# EAGLE design ShieldDuckSensor (EAGLE 6.5.0)
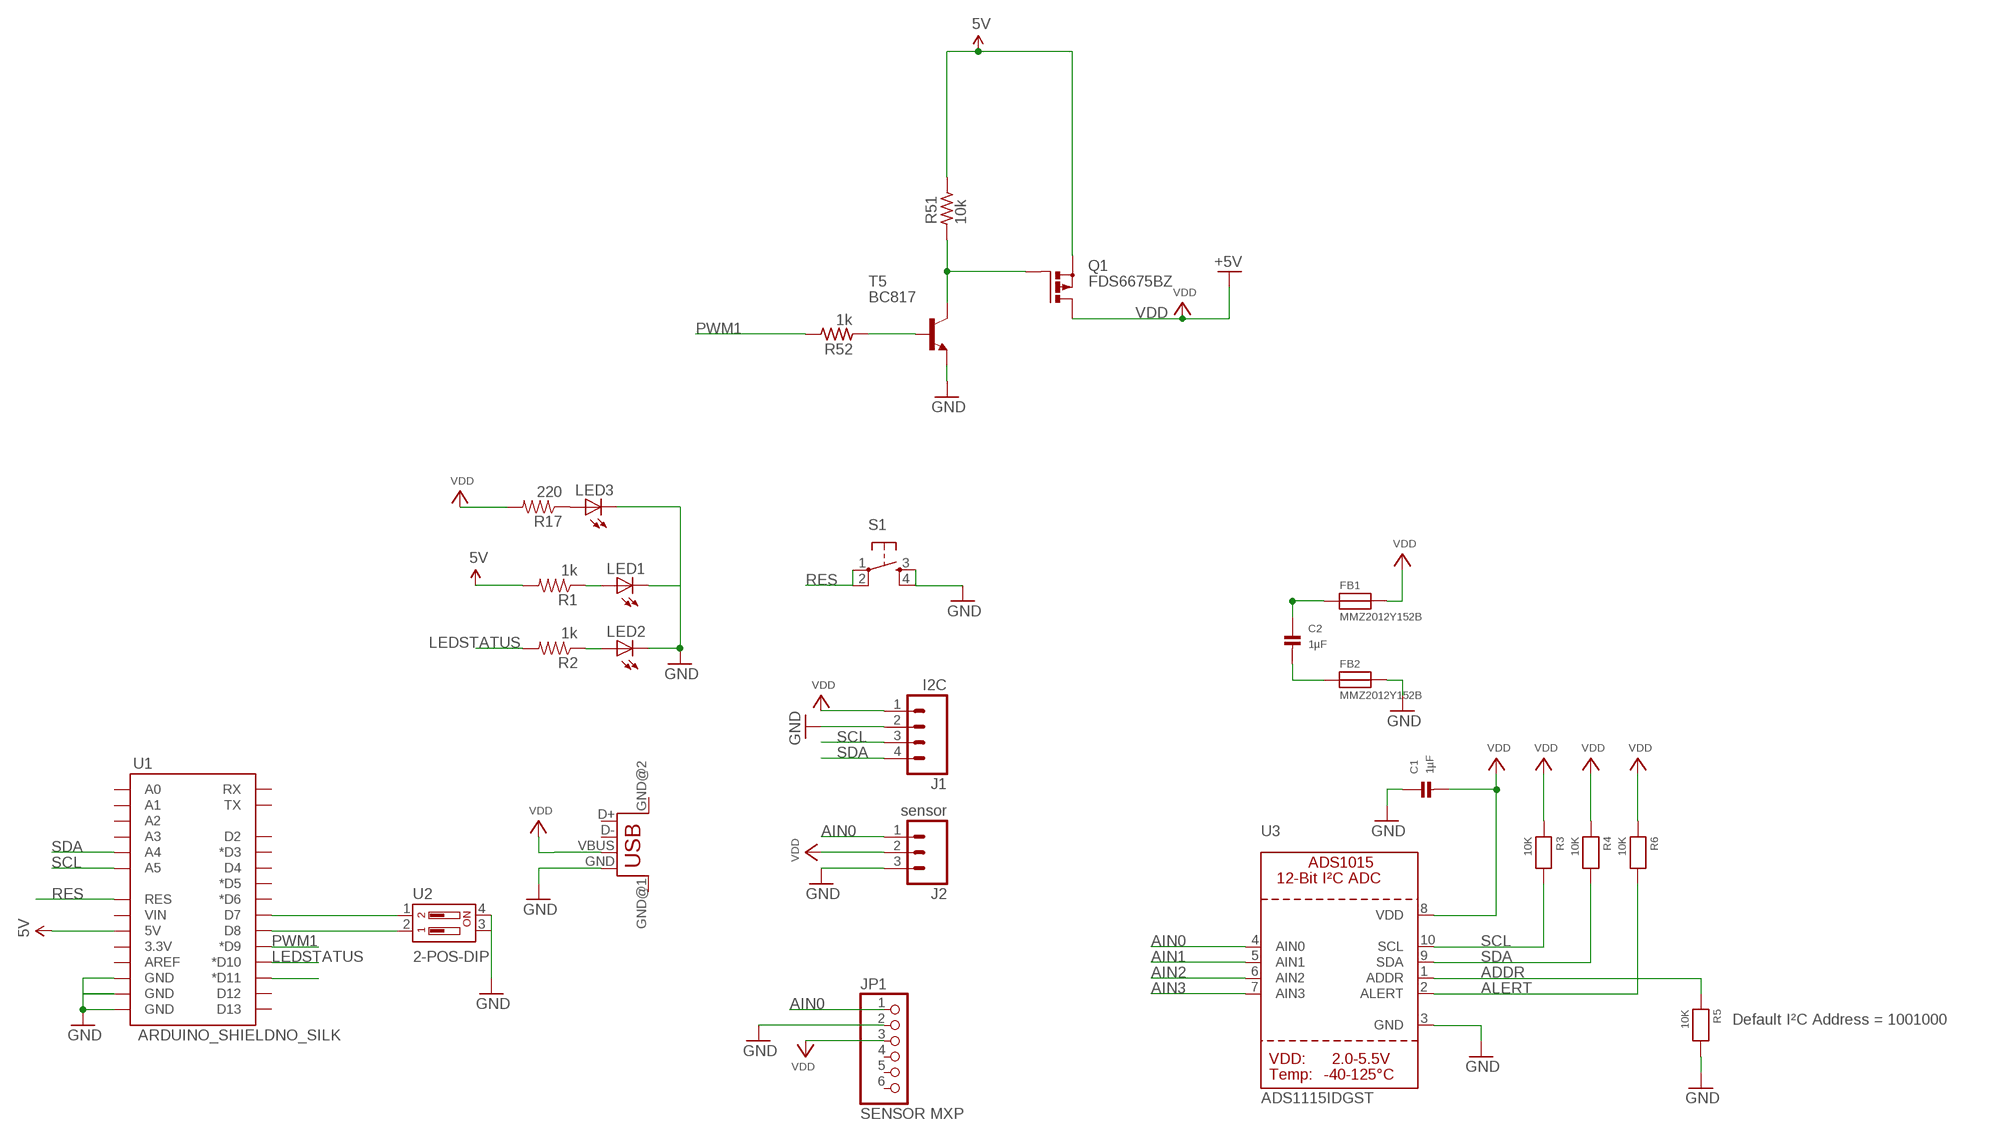
[diagram p0: schematic, sheet 1]

## Parts
C1  1µF  CAP_CERAMIC0805  [0805]
C2  1µF  CAP_CERAMIC0805  [0805]
FB1  MMZ2012Y152B  FERRITE0805  [0805]
FB2  MMZ2012Y152B  FERRITE0805  [0805]
J1  I2C  M04PTH  [1X04]
J2  sensor  M03PTH  [1X03]
JP1  SENSOR MXP  PINHD-1X6B  [1X06-BIG]
LED1  LED3MM  [LED3MM]
LED2  LED3MM  [LED3MM]
LED3  LED3MM  [LED3MM]
Q1  FDS6675BZ  P-MOSFET-SO8  [SO-08]
R1  1k  RESISTOR0805-RES  [0805]
R2  1k  RESISTOR0805-RES  [0805]
R3  10K  RESISTOR0805  [0805]
R4  10K  RESISTOR0805  [0805]
R5  10K  RESISTOR0805  [0805]
R6  10K  RESISTOR0805  [0805]
R17  220  RESISTOR0805-RES  [0805]
R51  10k  R_0805  [R0805]
R52  1k  R_0805  [R0805]
S1  TAC_SWITCHPTH  [TACTILE-PTH]
T5  BC817  BC817-16LT1-NPN-SOT23-BEC  [SOT23-BEC]
U1  ARDUINO_SHIELDNO_SILK  [DUEMILANOVE_VIAS]
U2  2-POS-DIP  2-POS-DIPCTS-THRU-HOLE  [209-2LPST]
U3  ADS1115IDGST  ADC_ADS1015  [MSOP10]
U$1  USB  [USB-FEMALE-A-PTH]

## Nets
5V: Q1.1(S) Q1.2(S) Q1.3(S) R1.2 R51.2 U1.5V
ADDR: R5.1 U3.1(ADDR)
AIN0: J2.1 JP1.1 U3.4(AIN0)
AIN1: U3.5(AIN1)
AIN2: U3.6(AIN2)
AIN3: U3.7(AIN3)
ALERT: R6.2 U3.2(ALERT)
GND: C1.1 FB2.2 J1.2 J2.3 JP1.2 LED1.K(C) LED2.K(C) LED3.K(C) R5.2 S1.3 S1.4 T5.E U1.GND@0(GND) U1.GND@1(GND) U1.GND@2(GND) U2.3 U2.4 U3.3(GND) U$1.GND
LEDSTATUS: R2.2 U1.D10(*D10)
N$2: LED1.A R1.1
N$3: U1.D7 U2.1
N$4: U1.D8 U2.2
N$5: LED2.A R2.1
N$6: C2.2 FB2.1
N$7: C2.1 FB1.1
N$11: U1.D11(*D11)
N$17: LED3.A R17.1
N$54: Q1.4(G) R51.1 T5.C
N$55: R52.1 T5.B
PWM1: R52.2 U1.D9(*D9)
RES: S1.1 S1.2 U1.RES
SCL: J1.3 R3.2 U1.A5 U3.10(SCL)
SDA: J1.4 R4.2 U1.A4 U3.9(SDA)
VDD: C1.2 FB1.2 J1.1 J2.2 JP1.3 Q1.5(D) Q1.6(D) Q1.7(D) Q1.8(D) R3.1 R4.1 R6.1 R17.2 U3.8(VDD) U$1.VBUS ; supply symbol labelled +5V
Unconnected: JP1.4 JP1.5 JP1.6 U1.3.3V U1.A0 U1.A1 U1.A2 U1.A3 U1.AREF U1.D2 U1.D3(*D3) U1.D4 U1.D5(*D5) U1.D6(*D6) U1.D12 U1.D13 U1.RX U1.TX U1.VIN U$1.D+ U$1.D- U$1.GND@1(GND) U$1.GND@2(GND)

## Notes on the sheet
- Default I²C Address = 1001000

## Library data of the parts
C1 C2 = microbuilder:CAP_CERAMIC: Ceramic Capacitors 0402 - 0402 Surface Mount Capacitors 16pF 50V 5% [Digikey: 445-4899-2-ND] 18pF 50V 5% [Digikey: 490-1281-2-ND] 22pF 50V 5% [Digikey: 490-1283-2-ND] 68pF 50V 5% [Digikey: 490-1289-2-ND] 0.1uF 10V 10% [Digikey: 490-1318-2-ND] 1.0uF 6.3V 10% [Digikey: 490-1320-2-ND] 0603 - 0603 Surface Mount Capacitors 16 pF 50V 5% [Digikey: 445-5051-2-ND] 22 pF 50V [Digikey: PCC220ACVTR-ND] 33 pF 50V 5% [Digikey: 490-1415-1-ND] 56pF 50V 5% [Digikey: 490-1421-1-ND] 220pF 50V 5% [Digikey: 445-1285-1-ND] 680 pF 50V 2200 pF 50V 5% C0G [Digikey: 445-1297-1-ND] 5600 pF 100V 5% X7R [Digikey: 478-3711-1-ND] 0.1 µF 25V 10% [Digikey: PCC2277TR-ND] 0.22 µF 16V 10% X7R [Digikey: 445-1318-1-ND] 1.0 µF 25V 10% [Digikey: 445-5146-2-ND] 0603 - RF Specific 3pF 250V +/-0.1pF RF [Digikey: 712-1347-1-ND] 18 pF 250V 5% [Digikey: 478-3505-1-ND or 712-1322-1-ND] 56 pF 250V 5% C0G RF [Digikey: 490-4867-1-ND] 68 pF 250V RF [Digikey: 490-4868-1-ND] 0805 - 0805 Surface Mount Capacitors 220 pF 250V 2% RF Ceramic Capacitor [Digikey: 712-1398-1-ND] 1000 pF 50V 2% NP0 Ceramic Capacitor [Digikey: 478-3760-1-ND] 0.1 µF 25V 10% Ceramic Capacitor [Digikey: PCC1828TR-ND] 1.0 µF 16V 10% Ceramic Capacitor[Digikey: 490-1691-2-ND] 10.0 µF 10V 10% Ceramic Capacitor[Digikey: 709-1228-1-ND] 10.0 uF 16V 10% Ceramic Capacitor [Digikey: 478-5165-2-ND] 47 uF 6.3V 20% Ceramic Capacitor [Digikey: 587-1779-1-ND or 399-5506-1-ND] 1206 - 1206 Surface Mount Capacitors 47uF 10V 20% Ceramic Capacitor [Digikey: 490-5528-1-ND or 399-5508-1-ND or 445-6010-1-ND] 100uF 6.3V -20%, +80% Y5V Ceramic Capacitor (Digikey: 490-4512-1-ND, Mouser: 81-GRM31CF50J107ZE1L)
FB1 FB2 = microbuilder:FERRITE: Ferrite Bead 0603 MMZ1608B121C - 120 Ohm, 600mA Ferrite Chip - Digikey: 445-2164-1-ND BK1608HW121-T - 120 Ohm, 600mA Ferrite Chip - Digikey: 587-1876-2-ND 0805 HZ0805B272R-10 - 2.7K Ohm @ 100MHz, 200mA 0.8 Ohm DC Resistance - Digikey: 240-2504-1-ND (see also Murata BLM21BD272SN1L)
J1 = SparkFun-Connectors:M04: Header 4 Standard 4-pin 0.1" header. Use with straight break away headers (SKU : PRT-00116), right angle break away headers (PRT-00553), swiss pins (PRT-00743), machine pins (PRT-00117), and female headers (PRT-00115). Molex polarized connector foot print use with SKU : PRT-08231 with associated crimp pins and housings. 1MM SMD Version SKU: PRT-10208; PROD_ID: CONN-09696
J2 = SparkFun-Connectors:M03: Header 3 Standard 3-pin 0.1" header. Use with straight break away headers (SKU : PRT-00116), right angle break away headers (PRT-00553), swiss pins (PRT-00743), machine pins (PRT-00117), and female headers (PRT-00115). Molex polarized connector foot print use with SKU : PRT-08232 with associated crimp pins and housings.
JP1 = adafruit:PINHD-1X6: PIN HEADER
LED1-LED3 = adafruit:LED: LED OSRAM: - CHIPLED LG R971, LG N971, LY N971, LG Q971, LY Q971, LO R971, LY R971 LH N974, LH R974 LS Q976, LO Q976, LY Q976 LO Q996 - Hyper CHIPLED LW Q18S LB Q993, LB Q99A, LB R99A - SideLED LS A670, LO A670, LY A670, LG A670, LP A670 LB A673, LV A673, LT A673, LW A673 LH A674 LY A675 LS A676, LA A676, LO A676, LY A676, LW A676 LS A679, LY A679, LG A679 - Hyper Micro SIDELED® LS Y876, LA Y876, LO Y876, LY Y876 LT Y87S - SmartLED LW L88C, LW L88S LB L89C, LB L89S, LG L890 LS L89K, LO L89K, LY L89K LS L896, LA L896, LO L896, LY L896 - TOPLED LS T670, LO T670, LY T670, LG T670, LP T670 LSG T670, LSP T670, LSY T670, LOP T670, LYG T670 LG T671, LOG T671, LSG T671 LB T673, LV T673, LT T673, LW T673 LH T674 LS T676, LA T676, LO T676, LY T676, LB T676, LH T676, LSB T676, LW T676 LB T67C, LV T67C, LT T67C, LS T67K, LO T67K, LY T67K, LW E67C LS E67B, LA E67B, LO E67B, LY E67B, LB E67C, LV E67C, LT E67C LW T67C LS T679, LY T679, LG T679 LS T770, LO T770, LY T770, LG T770, LP T770 LB T773, LV T773, LT T773, LW T773 LH T774 LS E675, LA E675, LY E675, LS T675 LS T776, LA T776, LO T776, LY T776, LB T776 LHGB T686 LT T68C, LB T68C - Hyper Mini TOPLED® LB M676 - Mini TOPLED Santana® LG M470 LS M47K, LO M47K, LY M47K Source: http://www.osram.convergy.de/
Q1 = transistor-power:P-MOSFET-SO8: P-Channel MOSFET Example: FDS4435A; P-Channel Logic Level PowerTrench® MOSFET FDS4465; P-Channel 1.8V Specified PowerTrench® MOSFET Source: www.fairchildsemi.com
R1 R2 R17 = SparkFun-Resistors:RESISTOR: Resistor Basic schematic elements and footprints for 0603, 1206, and PTH resistors.
R3-R6 = microbuilder:RESISTOR: Resistors 0402 - 0402 Surface Mount Package 22 Ohm 1% 1/16W [Digikey: 311-22.0LRTR-ND] 33 Ohm 5% 1/16W 1.0K 5% 1/16W 1.5K 5% 1/16W 2.0K 1% 1/16W 10.0K 1% 1/16W [Digikey: 311-10.0KLRTR-ND] 10.0K 5% 1/16W [Digikey: RMCF0402JT10K0TR-ND] 12.1K 1% 1/16W [Digikey: 311-22.0LRTR-ND] 100.0K 5% 1/16W 0603 - 0603 Surface Mount Package 0 Ohm 1/10 Watt 1% Resistor 15 Ohm 1/10 Watt 1% Resistor 33 Ohm 1/10 Watt 1% Resistor 49.9 Ohm 1/10 Watt 1% Resistor 100 Ohm 1/10 Watt 1% Resistor 150 Ohm 1/10 Watt 1% Resistor 240 Ohm 1/10 Watt 1% Resistor 390 Ohm 1/10 Watt 1% Resistor 560 Ohm 1/10 Watt 1% Resistor 680 Ohm 1/10 Watt 1% Resistor 750 Ohm 1/10 Watt 1% Resistor 1.0K Ohm 1/10 Watt 1% Resistor 1.5K Ohm 1/10 Watt 1% Resistor 2.0K Ohm 1/10 Watt 1% Resistor 2.2K Ohm 1/10 Watt 1% Resistor 3.3K Ohm 1/10 Watt 1% Resistor 4.7K Ohm 1/10 Watt 1% Resistor 10.0K Ohm 1/10 Watt 1% Resistor 12.0K Ohm 1/10 Watt 1% Resistor 12.1K Ohm 1/10 Watt 1% Resistor 20.0K Ohm 1/10 Watt 1% Resistor 33.0K Ohm 1/10 Watt 1% Resistor 100.0K Ohm 1/10 Watt 1% Resistor 0805 - 0805 Surface Mount Package 0 Ohm 1/8 Watt 1% Resistor 33 Ohm 1/8 Watt 1% Resistor 100 Ohm 1/8 Watt 1% Resistor 150 Ohm 1/8 Watt 1% Resistor 200 Ohm 1/8 Watt 1% Resistor 240 Ohm 1/8 Watt 1% Resistor 330 Ohm 1/8 Watt 1% Resistor 390 Ohm 1/8 Watt 1% Resistor 470 Ohm 1/8 Watt 1% Resistor 1.0K Ohm 1/8 Watt 1% Resistor 1.5K Ohm 1/8 Watt 1% Resistor 2.0K Ohm 1/8 Watt 1% Resistor 4.7K Ohm 1/8 Watt 1% Resistor 5.1K Ohm 1/8 Watt 1% Resistor 5.6K Ohm 1/8 Watt 1% Resistor 10.0K Ohm 1/8 Watt 1% Resistor 22.0K Ohm 1/8 Watt 1% Resistor 33.0K Ohm 1/8 Watt 1% Resistor 100K Ohm 1/8 Watt 1% Resistor 1206 - 1206 Surface Mount Package 2012 - 2010 Surface Mount Package 0.11 Ohm 1/2 Watt 1% Resistor - Digikey: RHM.11UCT-ND
R51 R52 = rc-master:R_: RESISTOR
S1 = SparkFun-Retired:TAC_SWITCH: Momentary Switch Button commonly used for reset or general input. Spark Fun Electronics SKU : COM-00097 SMT- SWCH-08247
T5 = transistor:*-NPN-: NPN Transistror BF959 corrected 2008.03.06
U1 = SparkFun-Boards:ARDUINO_SHIELD: Arduino shield footprint
U2 = SparkFun-Electromechanical:2-POS-DIP: SMD dip switch 2 positions; PROD_ID: SWCH-12532
U3 = microbuilder:ADC_ADS1015: ADS1015 - 12-bit 4-Channel I2C ADC with Internal PGA VDD: 2.0-5.5V Sampling Rate: 3.3ksps Gain Settings: 2/3, 1, 2, 4, 8, 16 I2C Address: ADDR low = 1001000x, ADDR high = 1001001x Internal Comparator The ADS1015 includes an internal comparator that can be set to output a high-level on ALERT when the conversion results exceeeds a pre-defined upper level, and will deassert itself when the level falls below a pre-defined lower threshold level. It can also be set to windowed mode where the ALERT pin will be asserted if the data exceeds the upper threshold or falls below the lower threshold.
U$1 = STUNTAZ:USB: USB Connectors USB-FEMALE-A-PTH: Through hole Female Type A Connector

## Net classes
1 power: width 0.508 mm, drill 0.305 mm, clearance 0.381 mm

## Board
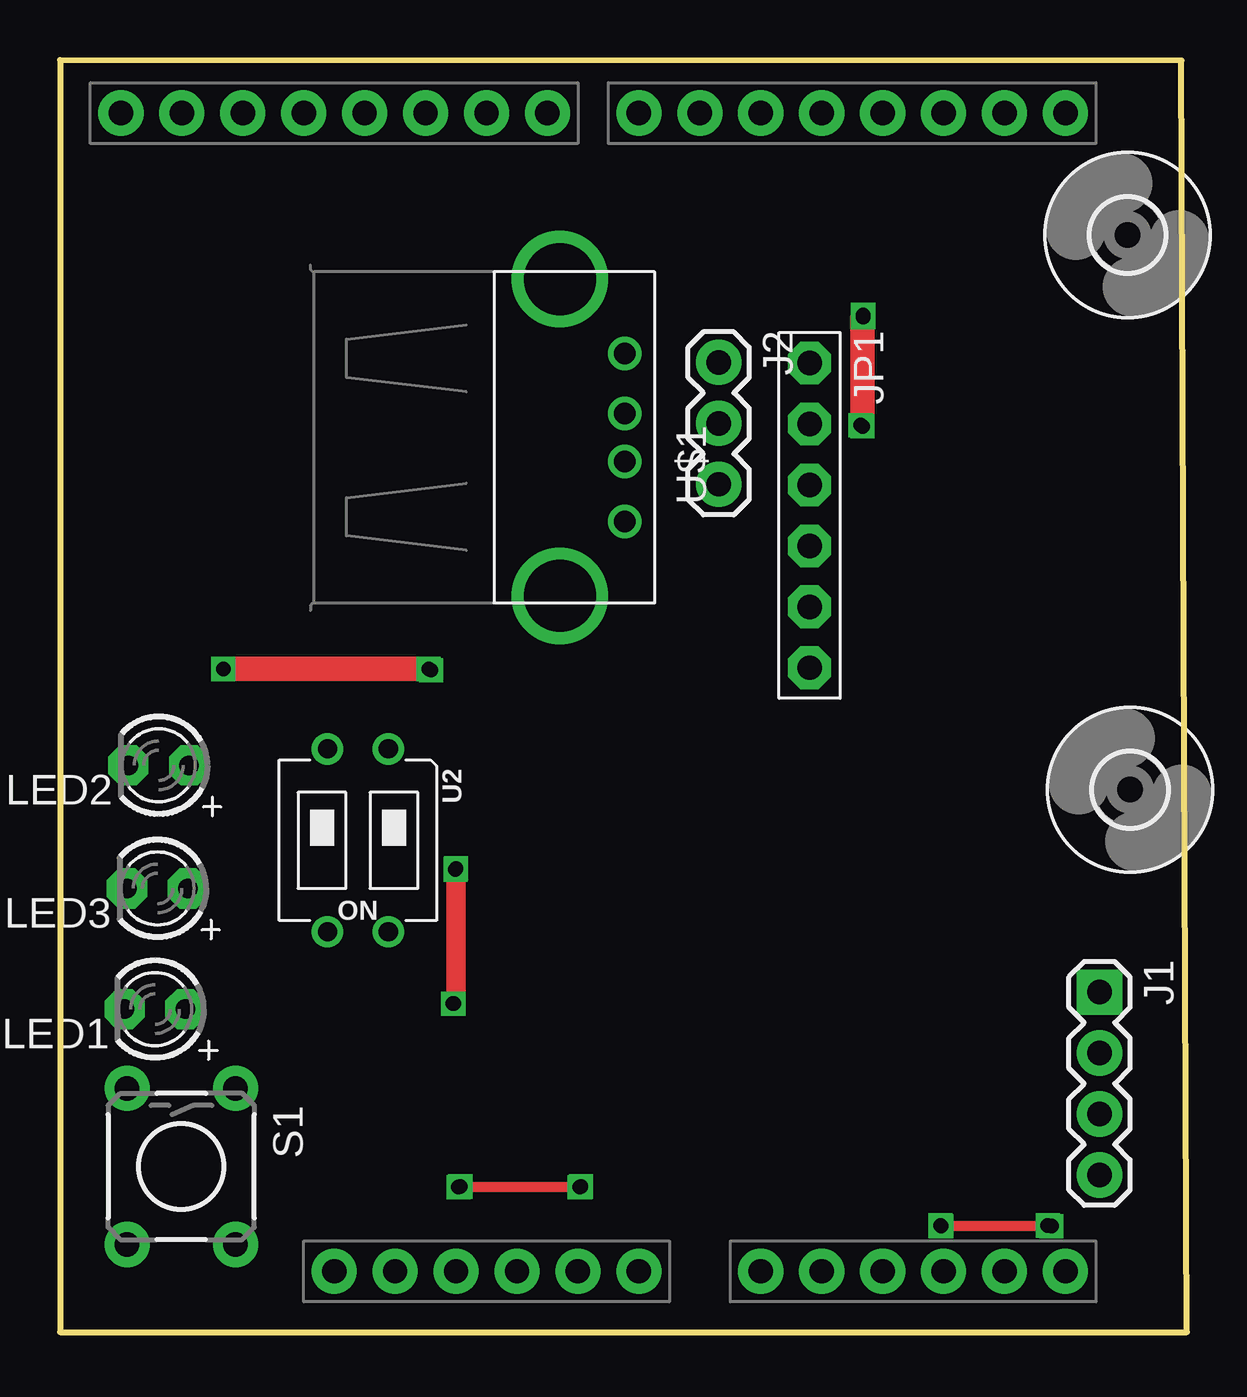
[diagram p1: board, top side]
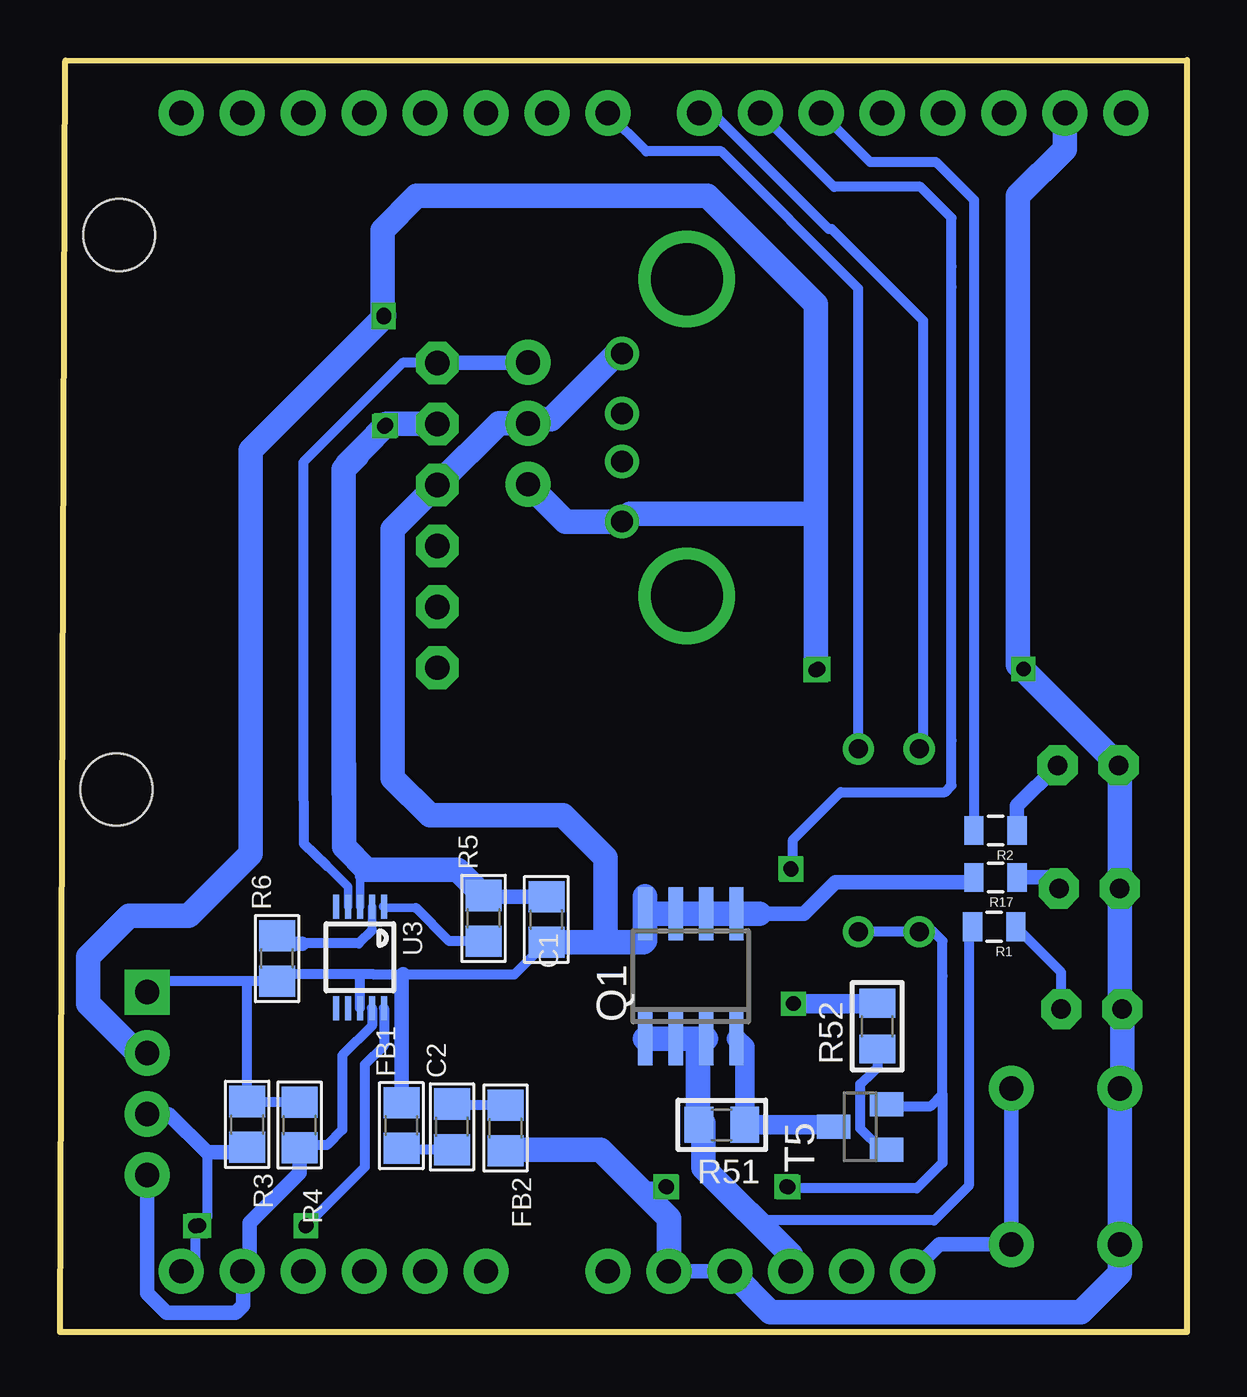
[diagram p2: board, bottom side, seen from below]

Size 46.97 x 53.01 mm. Coordinates in mm from the lower left corner, seen from the top.
Outline: 0,0 46.97,0 46.74,52.98 0,53.01 0,0
Copper layers (1*16): Top 0.035mm / dielectric 1.5mm / Bottom 0.035mm
Design rules "default": minimum track width 10mil, minimum drill 24mil, track to track 8mil, track to pad 8mil, pad to pad 8mil, via to via 8mil, smd to smd 8mil, copper to edge 40mil, drill to drill 8mil, minimum pad ring 10mil, minimum via ring 8mil, stop-mask expansion 4mil, vias tented up to drill 0mil, thermal gap 10mil

### Footprints (pad centres in the part's own frame; a part is rotated, then mirrored left to right if it is on the bottom)
0805 = smd 1.3 x 1.5: 1 -0.95,0; 2 0.95,0
1X04 = drill 1.016 pad 1.88 square: 1 0,0 | drill 1.016 pad 1.88: 2 2.54,0; 3 5.08,0; 4 7.62,0
1X03 = drill 1.016 pad 1.88: 1 0,0; 2 2.54,0; 3 5.08,0
1X06-BIG = drill 1.016 pad 1.778 octagon: 1 -6.35,0; 2 -3.81,0; 3 -1.27,0; 4 1.27,0; 5 3.81,0; 6 6.35,0
LED3MM = drill 0.813 pad 1.676 octagon: A -1.27,0; K 1.27,0
SO-08 = smd 0.6 x 2.2: 1 -1.905,-2.6; 2 -0.635,-2.6; 3 0.635,-2.6; 4 1.905,-2.6; 5 1.905,2.6; 6 0.635,2.6; 7 -0.635,2.6; 8 -1.905,2.6
0805' = smd 0.8 x 1.2: 1 -0.9,0; 2 0.9,0
R0805 = smd 1.2 x 1.5: 1 -0.953,0; 2 0.953,0
TACTILE-PTH = drill 1.016 pad 1.88: 1 -3.251,2.261; 2 3.251,2.261; 3 -3.251,-2.261; 4 3.251,-2.261
SOT23-BEC = smd 1 x 1.4: B -0.95,-1.1; C 0,1.1; E 0.95,-1.1
DUEMILANOVE_VIAS = drill 1.016 pad 1.88: 3.3V 50.8,13.97; 5V 50.8,16.51; A0 50.8,29.21; A1 50.8,31.75; A2 50.8,34.29; A3 50.8,36.83; A4 50.8,39.37; A5 50.8,41.91; AREF 2.54,2.54; D2 2.54,36.83; D3 2.54,34.29; D4 2.54,31.75; D5 2.54,29.21; D6 2.54,26.67; D7 2.54,24.13; D8 2.54,20.32; D9 2.54,17.78; D10 2.54,15.24; D11 2.54,12.7; D12 2.54,10.16; D13 2.54,7.62; GND@0 50.8,19.05; GND@1 50.8,21.59; GND@2 2.54,5.08; RES 50.8,11.43; RX 2.54,41.91; TX 2.54,39.37; VIN 50.8,24.13
209-2LPST = drill 0.8: 1 -1.27,-3.81; 2 1.27,-3.81; 3 1.27,3.81; 4 -1.27,3.81
MSOP10 = smd 0.25 x 1: 1 -1,-2.113; 2 -0.5,-2.113; 3 0,-2.113; 4 0.5,-2.113; 5 1,-2.113; 6 1,2.113; 7 0.5,2.113; 8 0,2.113; 9 -0.5,2.113; 10 -1,2.113
USB-FEMALE-A-PTH = drill 0.9: D+ 5.9,1.3; D- 7.9,1.3; GND 3.4,1.3; VBUS 10.4,1.3 | drill 3: GND@1 13.5,4; GND@2 0.3,4
3,0 = hole 3: 0,0

### Placement (x,y rotation side)
C1  26.7,17.2 270 bottom
C2  30.63,8.56 90 bottom
FB1  32.74,8.61 90 bottom
FB2  28.4,8.51 270 bottom
J1  43.33,14.17 270 top
J2  27.46,40.41 270 top
JP1  31.24,34.04 270 top
LED1  3.96,13.46 180 top
LED2  4.11,23.62 180 top
LED3  4.06,18.49 180 top
Q1  20.68,14.83 0 bottom
R1  1k  [0805']  8.03,16.89 180 bottom
R2  1k  [0805']  7.98,20.9 180 bottom
R3  39.17,8.66 270 bottom
R4  36.98,8.64 270 bottom
R5  29.31,17.25 90 bottom
R6  37.92,15.57 90 bottom
R17  220  [0805']  7.98,18.95 180 bottom
R51  19.38,8.64 180 bottom
R52  12.9,12.75 90 bottom
S1  5.05,6.91 270 top
T5  13.61,8.56 90 bottom
U1  0,53.34 270 top
U2  12.42,20.5 180 top
U3  34.47,15.62 180 bottom
U$1  24.84,30.38 90 top
U$3  [3,0]  44.5,45.72 90 top
U$6  [3,0]  44.61,22.61 90 top

### Tracks (layer width: path | path; a pad name or v marks a point on that pad's centre or on a via)
5V
  Bottom 0.406: R1.2 9.09,16.72 9.09,6.1 10.53,4.66 17.95,4.66
  Bottom 1.016: Q1.3 Q1.2 | Q1.2 20.57,12.23 | 20.57,12.23 Q1.1 Q1.2 | R51.2 20.38,8.94 | 20.38,8.94 20.38,12.04 20.57,12.23 | U1.5V 16.51,3.23 17.95,4.66 18.67,5.38 20.14,6.86 20.14,8.7 20.38,8.94
ADDR
  Bottom 0.356: 32.13,17.68 33.41,17.68
  Bottom 0.406: R5.1 30.75,16.3 32.13,17.68 | 33.41,17.68 U3.1
AIN0
  Bottom 0.356: U3.4 34.97,18.56 35.84,19.43
  Bottom 0.406: JP1.1 32.69,40.39 36.83,36.25 36.83,23.9 36.8,20.37 35.84,19.43
  Bottom 0.61: J2.1 27.48,40.39 JP1.1
ALERT
  Bottom 0.356: U3.2 33.97,16.76
  Bottom 0.406: 33.97,16.76 34.52,16.2 36.85,16.2 36.88,16.18
  Bottom 0.61: 36.88,16.18 37.63,16.18 R6.2
GND  (via drill 0.6)
  Top 0.406: v16.69,6.07 v21.72,6.07
  Top 1.016: v6.81,27.63 v15.37,27.63 15.42,27.63 v15.47,27.58 | v33.45,37.74 33.45,42.27 v33.48,42.29
  Bottom 0.356: 34.47,19 U3.3
  Bottom 0.406: 34.19,19.28 34.47,19 | U2.4 U2.3 10.57,16.69 10.18,16.31 10.18,14.83 10.18,9.91 | T5.E 12.43,9.42 10.67,9.42 10.18,9.91 | 10.18,9.91 10.18,7.06 11.25,5.99 16.61,5.99 v16.69,6.07 | v21.72,6.07 22.63,6.07 22.77,5.93 | 34.59,36.58 34.25,36.92
  Bottom 0.61: U1.GND@0 U1.GND@1 | C1.1 29.26,18.15 R5.2
  Bottom 1.016: U1.GND@1 21.59,4.75 22.77,5.93 24.44,7.6 28.36,7.6 FB2.2 | S1.4 2.79,3.12 | 2.79,3.12 2.79,2.46 4.42,0.84 17.35,0.84 U1.GND@0 | 2.79,3.12 S1.3 2.69,10.26 LED1.K 2.79,13.56 LED3.K 2.79,23.57 LED2.K 6.46,27.24 | v6.81,27.63 6.81,27.58 6.46,27.24 | v15.47,27.58 15.47,31.22 | 15.47,31.22 15.47,31.32 | U1.GND@2 5.08,49.3 7.04,47.35 7.04,27.81 6.46,27.24 | JP1.2 33.35,37.85 v33.45,37.74 33.45,37.72 34.25,36.92 34.59,36.58 | v33.48,42.29 33.45,42.39 | 15.47,34.11 15.47,42.82 19.99,47.35 21.21,47.35 32.11,47.35 33.53,45.92 33.53,42.34 v33.48,42.29 | 15.47,34.11 15.47,31.22 | 15.47,34.11 18.26,34.11 23.21,34.11 U$1.GND 25.9,33.78 J2.3 | 34.59,36.58 35,36.17 | v33.48,42.29 39.01,36.75 39.01,19.94 41.6,17.35 44.09,17.35 45.8,15.65 45.8,13.69 43.74,11.63 J1.2 | 34.59,36.58 34.59,36.52 35.05,36.07 35.15,35.97 35.15,25.32 35.15,22.45 35.13,23.65 35.13,20.22 34.19,19.28 30.39,19.28 R5.2
LEDSTATUS
  Bottom 0.406: U1.D10 13.21,48.77 10.46,48.77 8.88,47.18 R2.2
N$1  (via drill 0.6)
  other vias: 16.48,19.28
N$2
  Bottom 0.406: LED1.A 5.23,15 R1.1
N$3
  Bottom 0.406: U2.1 13.69,42.04 13.69,43.48 19.41,49.2 22.53,49.2 U1.D7
N$4
  Bottom 0.406: U1.D8 19.76,50.8 14.94,45.97 14.81,45.97 11,42.16 11,24.46 U2.2
N$5
  Bottom 0.61: LED2.A 7.08,21.93 R2.1
N$6
  Bottom 0.406: FB2.1 30.58,9.46 C2.2
N$7
  Bottom 0.406: C2.1 32.69,7.61 FB1.1
N$8  (via drill 0.6)
  other vias: 33.38,37.8
N$10  (via drill 0.6)
  other vias: 33.48,42.39
N$12  (via drill 0.6)
  other vias: 36.73,4.42
N$13  (via drill 0.6)
  other vias: 16.61,6.05
N$15  (via drill 0.6)
  other vias: 21.67,6.05
N$17
  Bottom 0.61: LED3.A 5.79,18.95 R17.1
N$54
  Bottom 0.813: T5.C 14.79,8.64 R51.1 18.43,11.89 Q1.4
N$55
  Bottom 0.406: R52.1 12.9,11.02 13.07,10.86 | 13.07,10.86 13.61,10.34 | T5.B 12.71,7.61 13.61,8.48 13.61,10.34 | 13.61,10.34 13.07,10.86
PWM1  (via drill 0.6)
  Top 0.813: v16.41,13.69 16.51,13.79 v16.51,19.33
  Bottom 0.406: v16.51,19.33 16.41,19.43 16.41,20.52 14.48,22.45 14.43,22.5 10.08,22.5 9.8,22.78 9.8,24.66 9.8,43.56 9.8,44.4 9.8,46.43 11.1,47.73 14.71,47.73 U1.D9
  Bottom 0.813: R52.2 12.92,13.69 v16.38,13.69 v16.41,13.69
RES
  Bottom 0.61: S1.1 S1.2 10.31,3.66 U1.RES
SCL  (via drill 0.6)
  Top 0.406: v36.7,4.44 v41.17,4.44 41.3,4.44 v41.33,4.42
  Bottom 0.406: U3.10 33.47,11.95 34.27,11.15 34.27,6.88 v36.7,4.44 | v41.33,4.42 41.33,3.12 U1.A5 | 40.84,7.49 40.84,4.78 v41.17,4.44
  Bottom 0.61: J1.3 42.44,9.09 40.84,7.49 39.38,7.49 R3.2
SDA
  Bottom 0.406: U3.9 33.97,12.77 35.2,11.53 35.2,8.43 35.84,7.8 36.87,7.8 R4.2
  Bottom 0.61: R4.2 36.98,6.65 39.06,4.57 39.06,2.85 U1.A4 39.34,2.51 39.34,1.12 39.65,0.81 42.52,0.81 43.33,1.63 J1.4
VDD
  Bottom 0.406: U3.8 34.47,14.33 34.47,14.91 34.52,14.91 | C1.2 28.03,14.91 32.66,14.91 33.88,14.91 34.52,14.91 | R3.1 39.14,9.59 R4.1 38.82,9.59 39.22,9.98 39.17,10.03 39.17,14.62 | 34.52,14.91 37.63,14.91 arc-90 R6.1 39.17,14.62 | 39.17,14.62 42.88,14.62 J1.1
  Bottom 0.61: 39.14,9.59 R3.1 | R17.2 9.08,18.74 14.66,18.74 15.97,17.43 17.8,17.43 | FB1.2 32.74,14.83 32.66,14.91
  Bottom 1.016: Q1.5 17.8,17.43 Q1.6 | Q1.6 Q1.7 | Q1.7 20.6,17.43 | 20.6,17.43 Q1.8 | Q1.6 Q1.7 | Q1.7 20.6,17.43 | Q1.7 Q1.8 | Q1.8 22.58,18.16 | C1.2 24.23,16.25 | 24.23,16.25 22.64,16.25 22.58,16.31 Q1.8 | U$1.VBUS 23.76,40.78 26.49,38.05 27.28,38.05 J2.2 28.68,37.87 JP1.3 33.1,33.45 33.1,23.09 31.55,21.54 26.01,21.54 24.23,19.76 24.23,16.25